# EAGLE design BatteryHolderSMD_CR1220 (EAGLE 9.2.2)
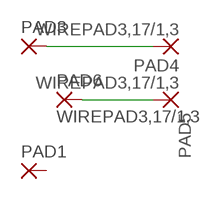
[diagram p0: schematic, sheet 1]

## Parts
PAD1  SMD5  [SMD2,54-5,08]
PAD3  SMD5  [SMD2,54-5,08]
PAD4  WIREPAD3,17/1,3  [3,17/1,3]
PAD5  WIREPAD3,17/1,3  [3,17/1,3]
PAD6  WIREPAD3,17/1,3  [3,17/1,3]

## Nets
N$1: PAD3.1(P) PAD4.1(P)
N$2: PAD5.1(P) PAD6.1(P)
Unconnected: PAD1.1(P)

## Library data of the parts
PAD1 PAD3 = wirepad:SMD5: SMD PAD
PAD4-PAD6 = wirepad:WIREPAD: Wire PAD connect wire on PCB

## Board
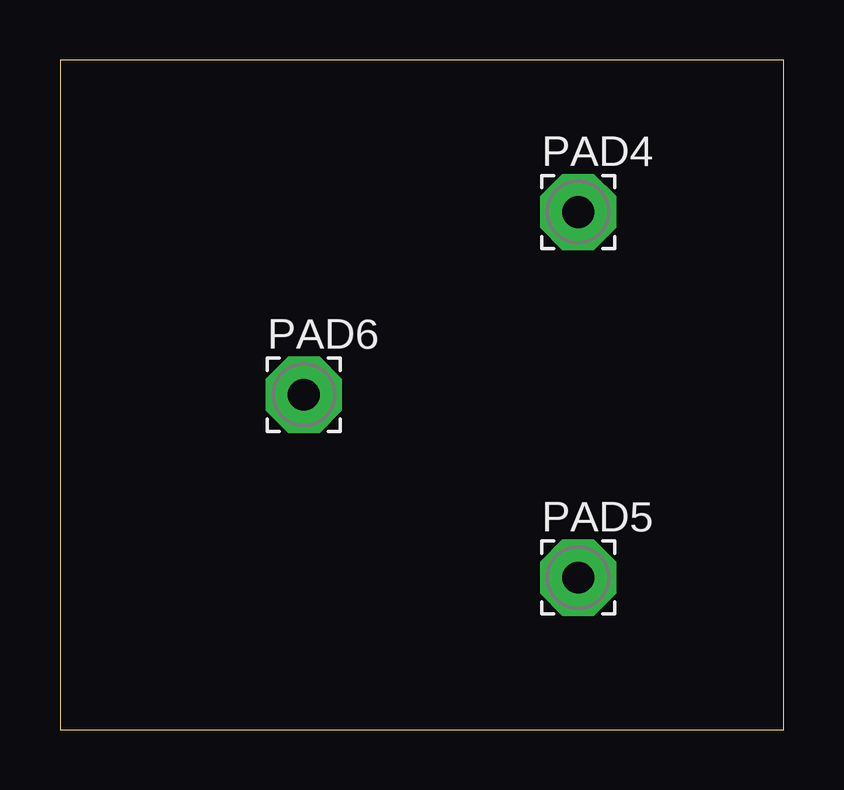
[diagram p1: board, top side]
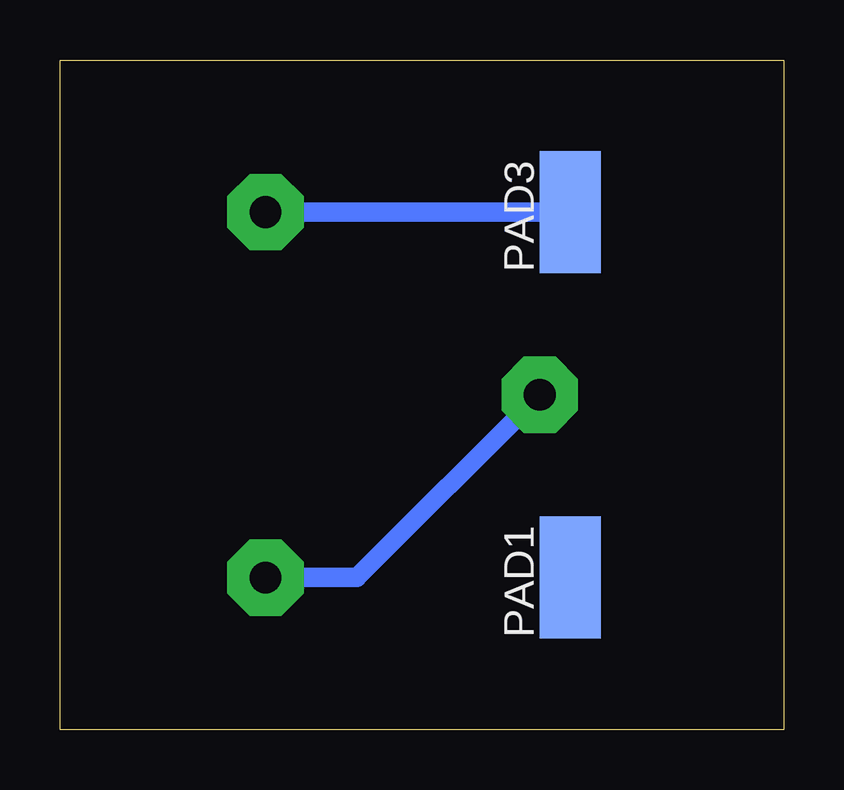
[diagram p2: board, bottom side, seen from below]

Size 30.15 x 27.93 mm. Coordinates in mm from the lower left corner, seen from the top.
Outline: 0,0 30.15,0 30.15,27.93 0,27.93 0,0
Copper layers (1*16): Top 0.035mm / dielectric 1.5mm / Bottom 0.035mm
Design rules "default": minimum track width 6mil, minimum drill 0.35mm, track to track 6mil, track to pad 6mil, pad to pad 6mil, via to via 6mil, smd to smd 6mil, copper to edge 40mil, drill to drill 6mil, minimum pad ring 10mil, minimum via ring 8mil, stop-mask expansion 4mil, vias tented up to drill 0mil, thermal gap 10mil

### Footprints (pad centres in the part's own frame; a part is rotated, then mirrored left to right if it is on the bottom)
SMD2,54-5,08 = smd 2.54 x 5.08: 1 0,0
3,17/1,3 = drill 1.321 pad 3.175 octagon: 1 0,0

### Placement (x,y rotation side)
PAD1  8.89,6.35 0 bottom
PAD3  8.89,21.59 0 bottom
PAD4  21.59,21.59 0 top
PAD5  21.59,6.35 0 top
PAD6  10.16,13.97 0 top

### Tracks (layer width: path | path; a pad name or v marks a point on that pad's centre or on a via)
N$1
  Bottom 0.813: PAD3.1 PAD4.1
N$2
  Bottom 0.813: PAD5.1 17.78,6.35 PAD6.1